# EAGLE design RF-Test-1 (EAGLE 6.4)
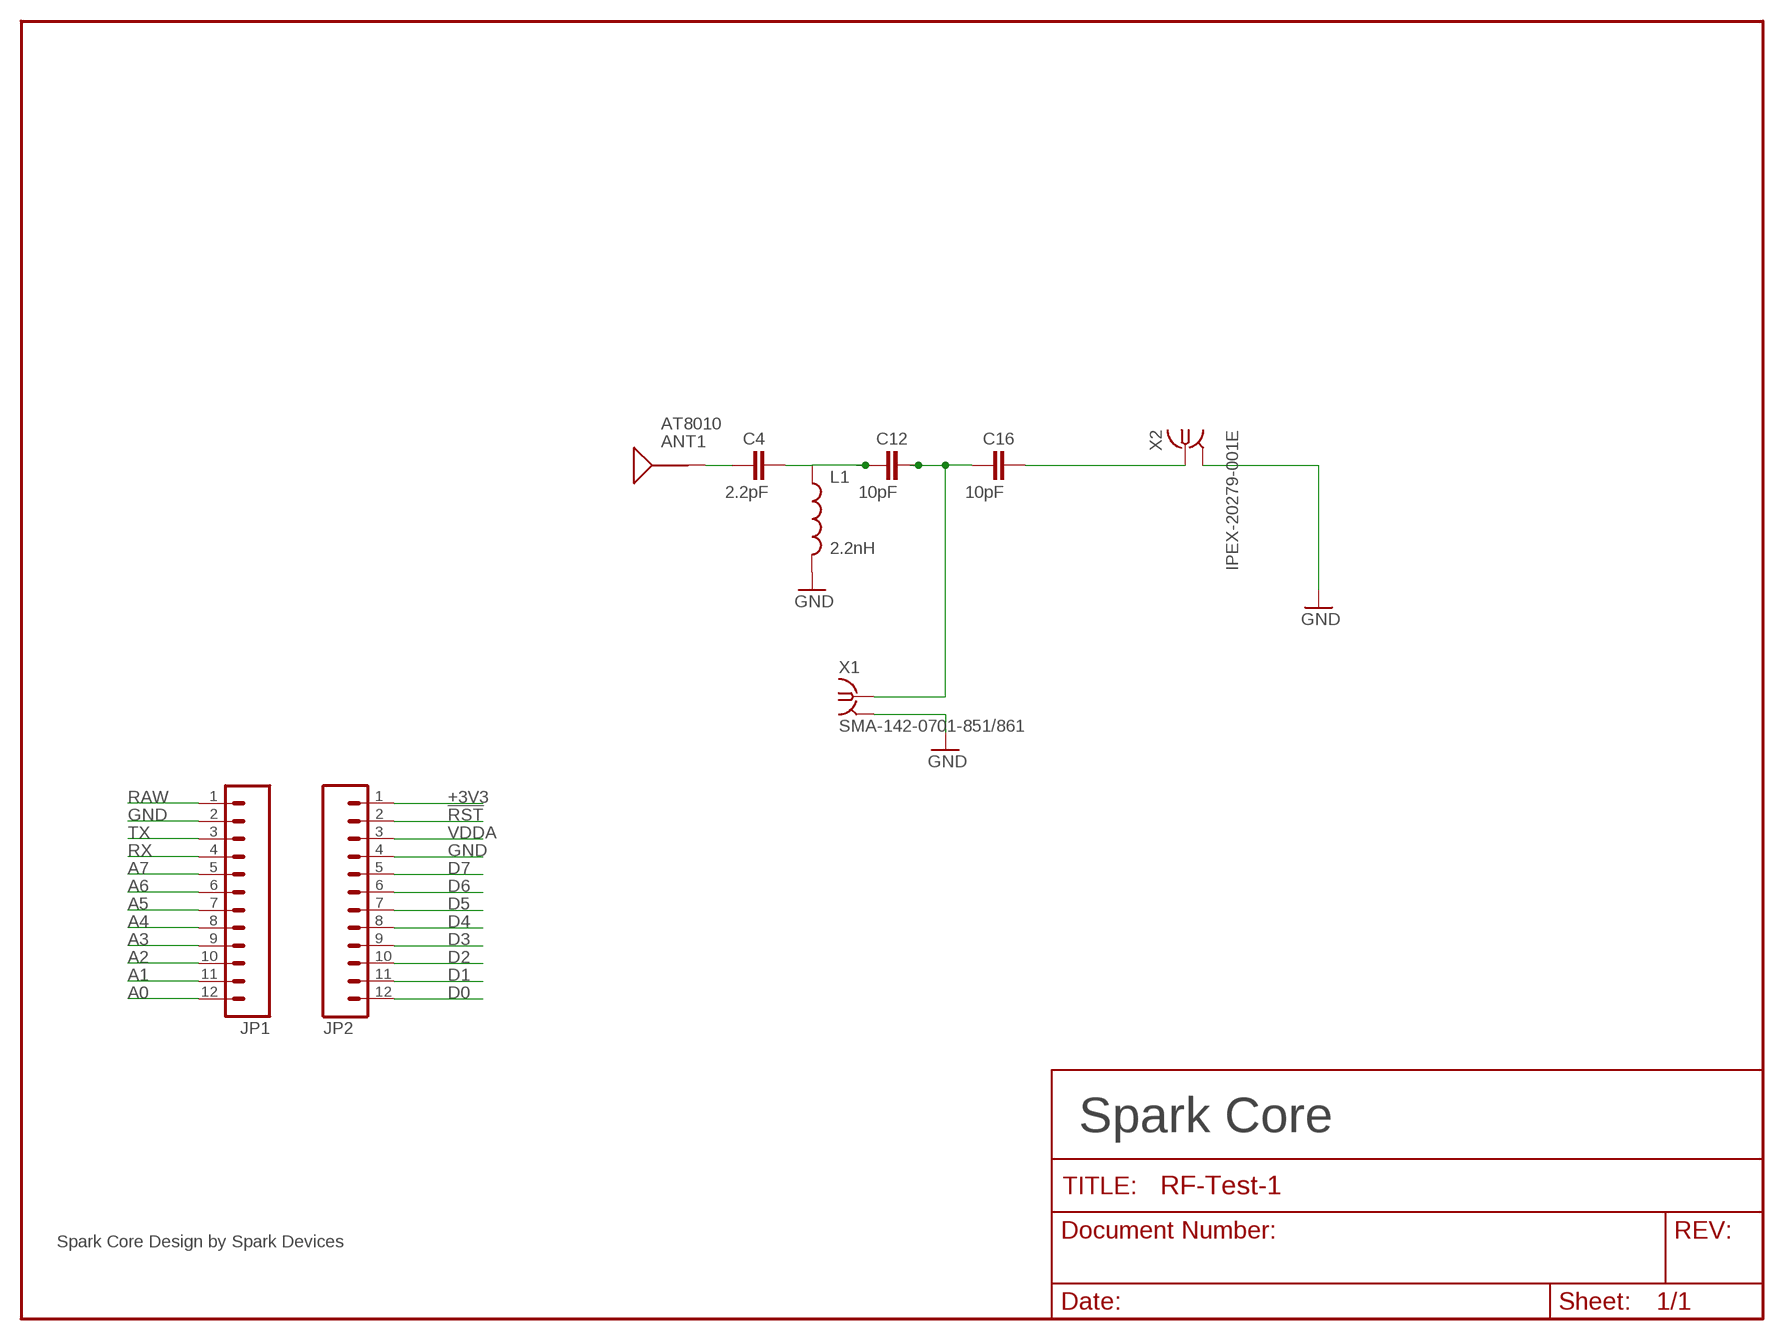
[diagram p0: schematic, sheet 1]

## Parts
ANT1  AT8010  [AT8010]
C4  2.2pF  C-EUC0603  [C0603]
C12  10pF  C-EUC0603  [C0603]
C16  10pF  C-EUC0603  [C0603]
JP1  M12PTH  [1X12]
JP2  M12PTH  [1X12]
L1  2.2nH  INDUCTOR0603  [0603]
X1  SMA-142-0701-851/861  [J502-ND-142-0701-851/861]
X2  IPEX-20279-001E  [IPEX-20279-001E]

## Nets
!RST: JP2.2
+3V3: JP2.1
A0: JP1.12
A1: JP1.11
A2: JP1.10
A3: JP1.9
A4: JP1.8
A5: JP1.7
A6: JP1.6
A7: JP1.5
D0: JP2.12
D1: JP2.11
D2: JP2.10
D3: JP2.9
D4: JP2.8
D5: JP2.7
D6: JP2.6
D7: JP2.5
GND [vcc]: JP1.2 JP2.4 L1.2 X1.G@1 X1.G@2 X1.G@3 X1.G@4 X2.2@1(GND) X2.2@2(GND)
N$2 [RF]: C16.2 X2.1
N$3 [RF]: ANT1.SIG(SIGNAL) C4.1
N$4 [RF2]: C12.2 C16.1 X1.1
N$5 [RF]: C4.2 C12.1 L1.1
RAW [vcc]: JP1.1
RX: JP1.4
TX: JP1.3
VDDA: JP2.3

## Notes on the sheet
- Spark Core
- Spark Core Design by Spark Devices

## Library data of the parts
ANT1 = Spark:AT8010: AT8010 Series Multilayer Chip Antenna
C4 C12 C16 = rcl:C-EU: CAPACITOR, European symbol
JP1 JP2 = SparkFun:M12: Header 12 Standard 12-pin 0.1" header. Use with straight break away headers (SKU : PRT-00116), right angle break away headers (PRT-00553), swiss pins (PRT-00743), machine pins (PRT-00117), and female headers (PRT-00115).
L1 = SparkFun-Passives:INDUCTOR: Inductors Basic Inductor/Choke - 0603 and 1206. Footprints are not proven and vary greatly between part numbers.
X1 = con-coax:SMA-: SMA 50 Ohm End Launch Jack Receptacle - Round Contact Johnson Components Source: www.johnsoncomponents.com .. J502-ND.pdf; MF: JOHNSON COMPONENTS; MPN: 142-0701-851; OC_FARNELL: 1019325; OC_NEWARK: 99F6798
X2 = Spark:IPEX-20279-001E: Ultra Miniature Coaxial SMT RF Receptacle

## Net classes
2 RF: width 0.635 mm, clearance 0.762 mm
3 RF2: width 0.635 mm, clearance 1.143 mm

## Board
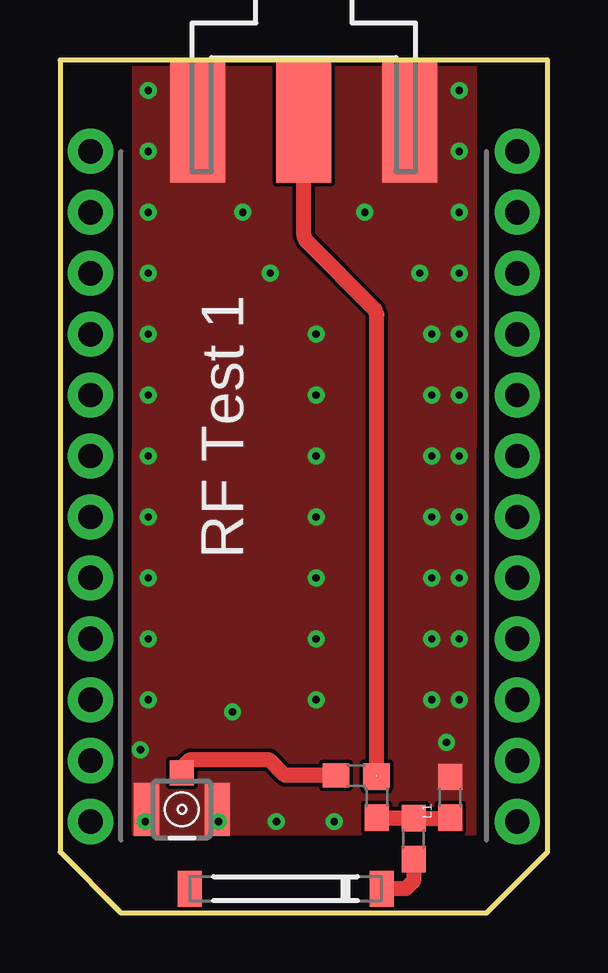
[diagram p1: board, top side]
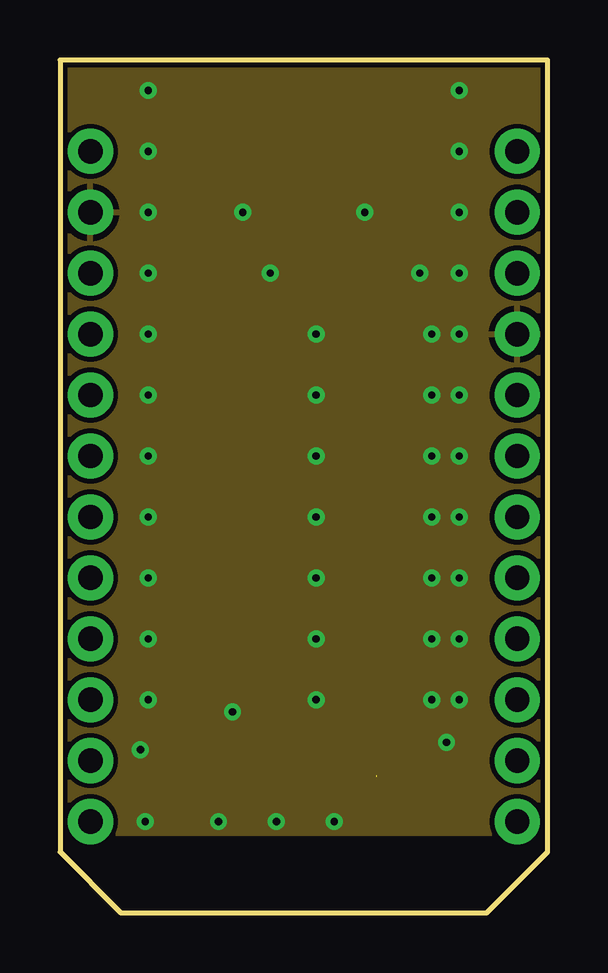
[diagram p2: board, inner layer $GND]
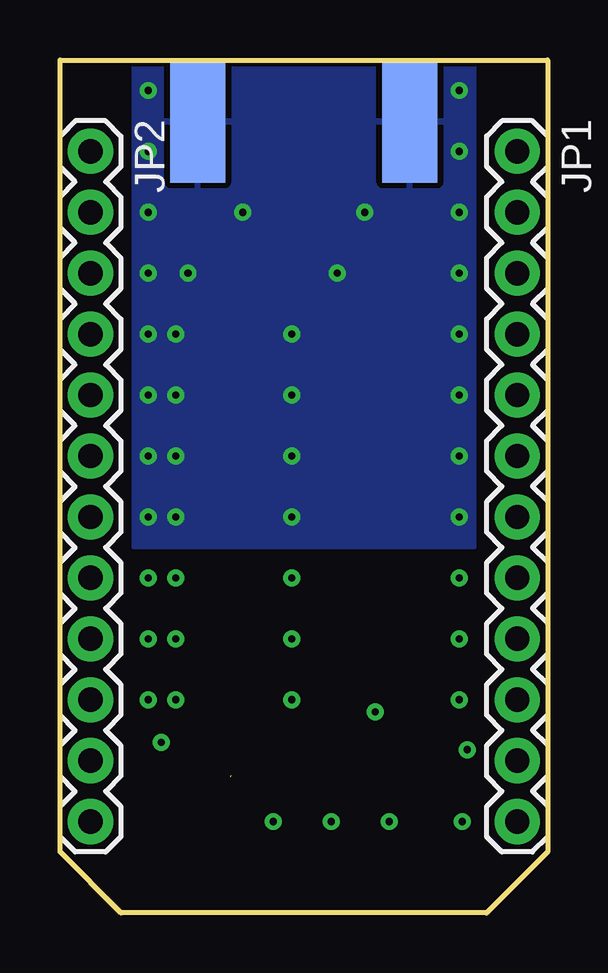
[diagram p3: board, bottom side, seen from below]

Size 20.32 x 35.56 mm. Coordinates in mm from the lower left corner, seen from the top.
Outline: 0,35.56 0,2.54 2.54,0 17.78,0 20.32,2.54 20.32,35.56 0,35.56
Copper layers (1+2*15+16): Top 0.035mm / dielectric 1.5mm / $GND 0.035mm / dielectric 0.15mm / $+3V3 0.035mm / dielectric 0.2mm / Bottom 0.035mm
Design rules "spark": minimum track width 6mil, minimum drill 0.3mm, track to track 6mil, track to pad 6mil, pad to pad 6mil, via to via 6mil, smd to smd 6mil, copper to edge 6mil, drill to drill 6mil, minimum pad ring 12mil, minimum via ring 8mil, stop-mask expansion 4mil, vias tented up to drill 20mil, thermal gap 10mil

### Footprints (pad centres in the part's own frame; a part is rotated, then mirrored left to right if it is on the bottom)
AT8010 = smd 1 x 1.5: NC -4,0; SIG 4,0
C0603 = smd 1.1 x 1: 1 -0.85,0; 2 0.85,0
1X12 = drill 1.016 pad 1.88: 1 0,0; 2 2.54,0; 3 5.08,0; 4 7.62,0; 5 10.16,0; 6 12.7,0; 7 15.24,0; 8 17.78,0; 9 20.32,0; 10 22.86,0; 11 25.4,0; 12 27.94,0
0603 = smd 1.1 x 1: 1 -0.85,0; 2 0.85,0
J502-ND-142-0701-851/861 = smd 5.08 x 2.286: 1 2.565,0; G@1 2.565,4.42; G@2 2.565,-4.42 | smd 5.08 x 2.286 bottom: G@3 2.565,4.42; G@4 2.565,-4.42
IPEX-20279-001E = smd 1 x 1.05: 1 0,1.528 | smd 1.05 x 2.2: 2@1 -1.475,0; 2@2 1.475,0

### Placement (x,y rotation side)
ANT1  9.4,1.02 0 top
C4  14.73,3.1 90 top
C12  13.21,4.83 90 top
C16  12.34,5.74 180 top
JP1  1.27,31.75 270 bottom
JP2  19.05,31.75 270 bottom
L1  16.26,4.83 90 top
X1  10.16,35.56 270 top
X2  5.08,4.32 0 top

### Tracks (layer width: path | path; a pad name or v marks a point on that pad's centre or on a via)
GND  (via drill 0.3)
  other vias: 3.35,6.81 3.56,3.81 6.6,3.81 9.02,3.81 11.43,3.81 3.68,34.29 3.68,31.75 3.68,29.21 3.68,26.67 3.68,24.13 3.68,21.59 3.68,19.05 3.68,16.51 3.68,13.97 3.68,11.43 16.64,34.29 7.62,29.21 16.64,31.75 16.64,29.21 16.64,26.67 16.64,24.13 16.64,21.59 16.64,19.05 16.64,16.51 16.64,13.97 16.64,11.43 16.64,8.89 8.76,26.67 10.67,24.13 10.67,21.59 10.67,19.05 10.67,16.51 10.67,13.97 10.67,11.43 10.67,8.89 15.49,8.89 15.49,11.43 15.49,13.97 15.49,16.51 15.49,19.05 15.49,21.59 15.49,24.13 14.99,26.67 12.7,29.21 3.68,8.89 7.19,8.38 16.1,7.11
  pour $GND (isolate 0.203): 0,35.56 20.32,35.56 20.32,3.3 0,3.3
  pour Top (no thermals): 3.05,3.3 3.07,35.51 17.3,35.51 17.27,3.3
  pour Bottom: 3.05,35.56 17.27,35.56 17.27,15.24 3.05,15.24
N$2
  Top 0.635: C16.2 9.37,5.74 8.74,6.38 5.4,6.38 5.08,6.06 X2.1
N$3
  Top 0.635: C4.1 14.73,1.33 14.41,1.02 ANT1.SIG
N$4  (1 unrouted)
  Top 0.635: C16.1 13.16,5.78 | C12.2 13.21,24.94 13.12,25.16 10.25,28.02 10.16,28.25 X1.1
N$5
  Top 0.635: C12.1 14.71,3.98 C4.2 16.23,3.95 L1.1

### Text on the board
tNames: RF Test 1